# Altium schematic sheet Clock_Source.SchDoc
size A; SheetNumber: 8; SheetTotal: 9
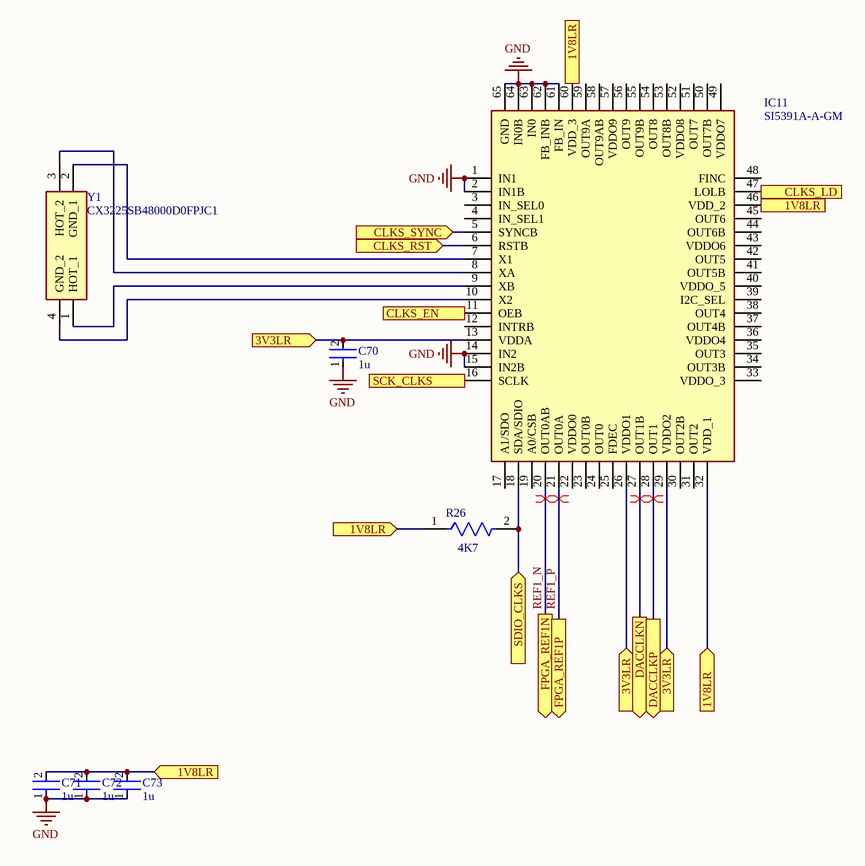
[diagram p0: Clock_Source.SchDoc]

## Parts
C70  1u  [FP-GRM155-0_1-MFG]
C71  1u  [FP-GRM155-0_1-MFG]
C72  1u  [FP-GRM155-0_1-MFG]
C73  1u  [FP-GRM155-0_1-MFG]
IC11  SI5391A-A-GM  [QFN50P900X900X90-65N-D]
R26  4K7  [FP-RT0402-MFG]
Y1  CX3225SB48000D0FPJC1  [CX3225SA40000D0PSVC1]

## Ports
1V8LR (in), 3V3LR (in), CLKS_EN (in), CLKS_LD (out), CLKS_RST (in), CLKS_SYNC (in), DACCLKN (out), DACCLKP (out), FPGA_REF1N (out), FPGA_REF1P (out), SCK_CLKS (in), SDIO_CLKS (in)

## Nets
GND: C70.1 C71.1 C72.1 C73.1 IC11.1(IN1) IC11.2(IN1B) IC11.14(IN2) IC11.15(IN2B) IC11.61(FB_IN) IC11.62(FB_INB) IC11.63(IN0) IC11.64(IN0B) IC11.65(GND)
1V8LR: C71.2 C72.2 C73.2 IC11.32(VDD_1) IC11.46(VDD_2) IC11.60(VDD_3) R26.1 ; port 1V8LR
3V3LR: C70.2 IC11.13(VDDA) IC11.26(VDDO1) IC11.29(VDDO2) ; port 3V3LR
CLKS_EN: IC11.11(OEB) ; port CLKS_EN
CLKS_LD: IC11.47(LOLB) ; port CLKS_LD
CLKS_RST: IC11.6(RSTB) ; port CLKS_RST
CLKS_SYNC: IC11.5(SYNCB) ; port CLKS_SYNC
DACCLKN: IC11.27(OUT1B) ; port DACCLKN
DACCLKP: IC11.28(OUT1) ; port DACCLKP
REF1_N: IC11.20(OUT0AB) ; port FPGA_REF1N
REF1_P: IC11.21(OUT0A) ; port FPGA_REF1P
SCK_CLKS: IC11.16(SCLK) ; port SCK_CLKS
SDIO_CLKS: IC11.18(SDA/SDIO) R26.2 ; port SDIO_CLKS
NetIC11_7: IC11.7(X1) Y1.2(GND_1)
NetIC11_8: IC11.8(XA) Y1.3(HOT_2)
NetIC11_9: IC11.9(XB) Y1.1(HOT_1)
NetIC11_10: IC11.10(X2) Y1.4(GND_2)

Not connected (* = marked no-connect by the designer): IC11 3(IN_SEL0) 4(IN_SEL1) 12(INTRB) 17(A1/SDO) 19(A0/CSB) 22(VDDO0) 23(OUT0B) 24(OUT0) 25(FDEC) 30(OUT2B) 31(OUT2) 33(VDDO_3) 34(OUT3B) 35(OUT3) 36(VDDO4) 37(OUT4B) 38(OUT4) 39(I2C_SEL) 40(VDDO_5) 41(OUT5B) 42(OUT5) 43(VDDO6) 44(OUT6B) 45(OUT6) 48(FINC) 49(VDDO7) 50(OUT7B) 51(OUT7) 52(VDDO8) 53(OUT8B) 54(OUT8) 55(OUT9B) 56(OUT9) 57(VDDO9) 58(OUT9AB) 59(OUT9A)

## Layout directives
differential pair: DACCLKN, DACCLKP, REF1_N, REF1_P

## Library data of the parts
C70-C73 = CMP-06035-041084-1: Chip Multilayer Ceramic Capacitors for General Purpose, 0402, 1.0uF, X5R, 15%, 10%, 50V
IC11 = SI5391A-A-GM: Integrated Circuit; Manufacturer_Name: Skyworks; Datasheet Link: https://www.skyworksinc.com/-/media/Skyworks/SL/documents/public/data-sheets/si5391-datasheet.pdf; Height: 0.9mm; Manufacturer_Part_Number: SI5391A-A-GM
R26 = CMP-2002-02901-2: RES 4.70K OHM 1/16W 1% SMD 0402; Manufacturer Part Number: RT0402FRE074K7L; Manufacturer: Yageo; Voltage Rating: 50V; Temperature Coefficient: 50 ppm/°C; Value: 4.7KΩ; Tolerance: 0.01; Power Rating: 0.063W; ComponentLink2URL: http://www.yageo.com/documents/recent/PYu-RT_1-to-0.01_RoHS_L_9.pdf; Temperature Range High: +155°C; Mouser Description: Res Thin Film 0402 4.7K Ohm 1% 1/16W ±50ppm/°C SMD Paper T/R; Temperature Range Low: -55°C; Device Class L1: Passive Components; Lead Free: Yes; Series: RT; Resistance: 4.7KΩ; Automotive: No; Package: RT0402; Composition: Thin Film; RoHS: TRUE; ComponentLink2Description: Datasheet; Octopart: https://octopart.com/rt0402fre074k7l-yageo-1371922; Footprint Url: http://www.yageo.com/exep/pages/download/literatures/PYu-R_Mount_10.pdf; Height: 0.35mm; Category: Res; Device Class L3: Chip SMD Resistors; Temperature: -55°C to +155°C; Digikey Description: RES 4.70K OHM 1/16W 1% SMD 0402; Device Class L2: Resistors; Ipc Land Pattern Name: RESC10050X30
Y1 = CX3225SA40000D0PSVC1: Crystal or Oscillator; Manufacturer_Name: KYOCERA; Datasheet Link: https://www.mouser.cn/datasheet/2/40/Kyocera_03282023_Mouser_CX3225SA40000D0PSVC1_UKY1C-3134464.pdf; Height: 0.8mm; Manufacturer_Part_Number: CX3225SA40000D0PSVC1; Mouser Part Number: 581-CX3225SA40DPSVC1; Mouser Price/Stock: https://www.mouser.co.uk/ProductDetail/KYOCERA-AVX/CX3225SA40000D0PSVC1?qs=9vOqFld9vZW3kz2Es9bwkA%3D%3D